# EAGLE design Adafruit 3.5in 480x320 FeatherWing Rev B (EAGLE 9.6.2)
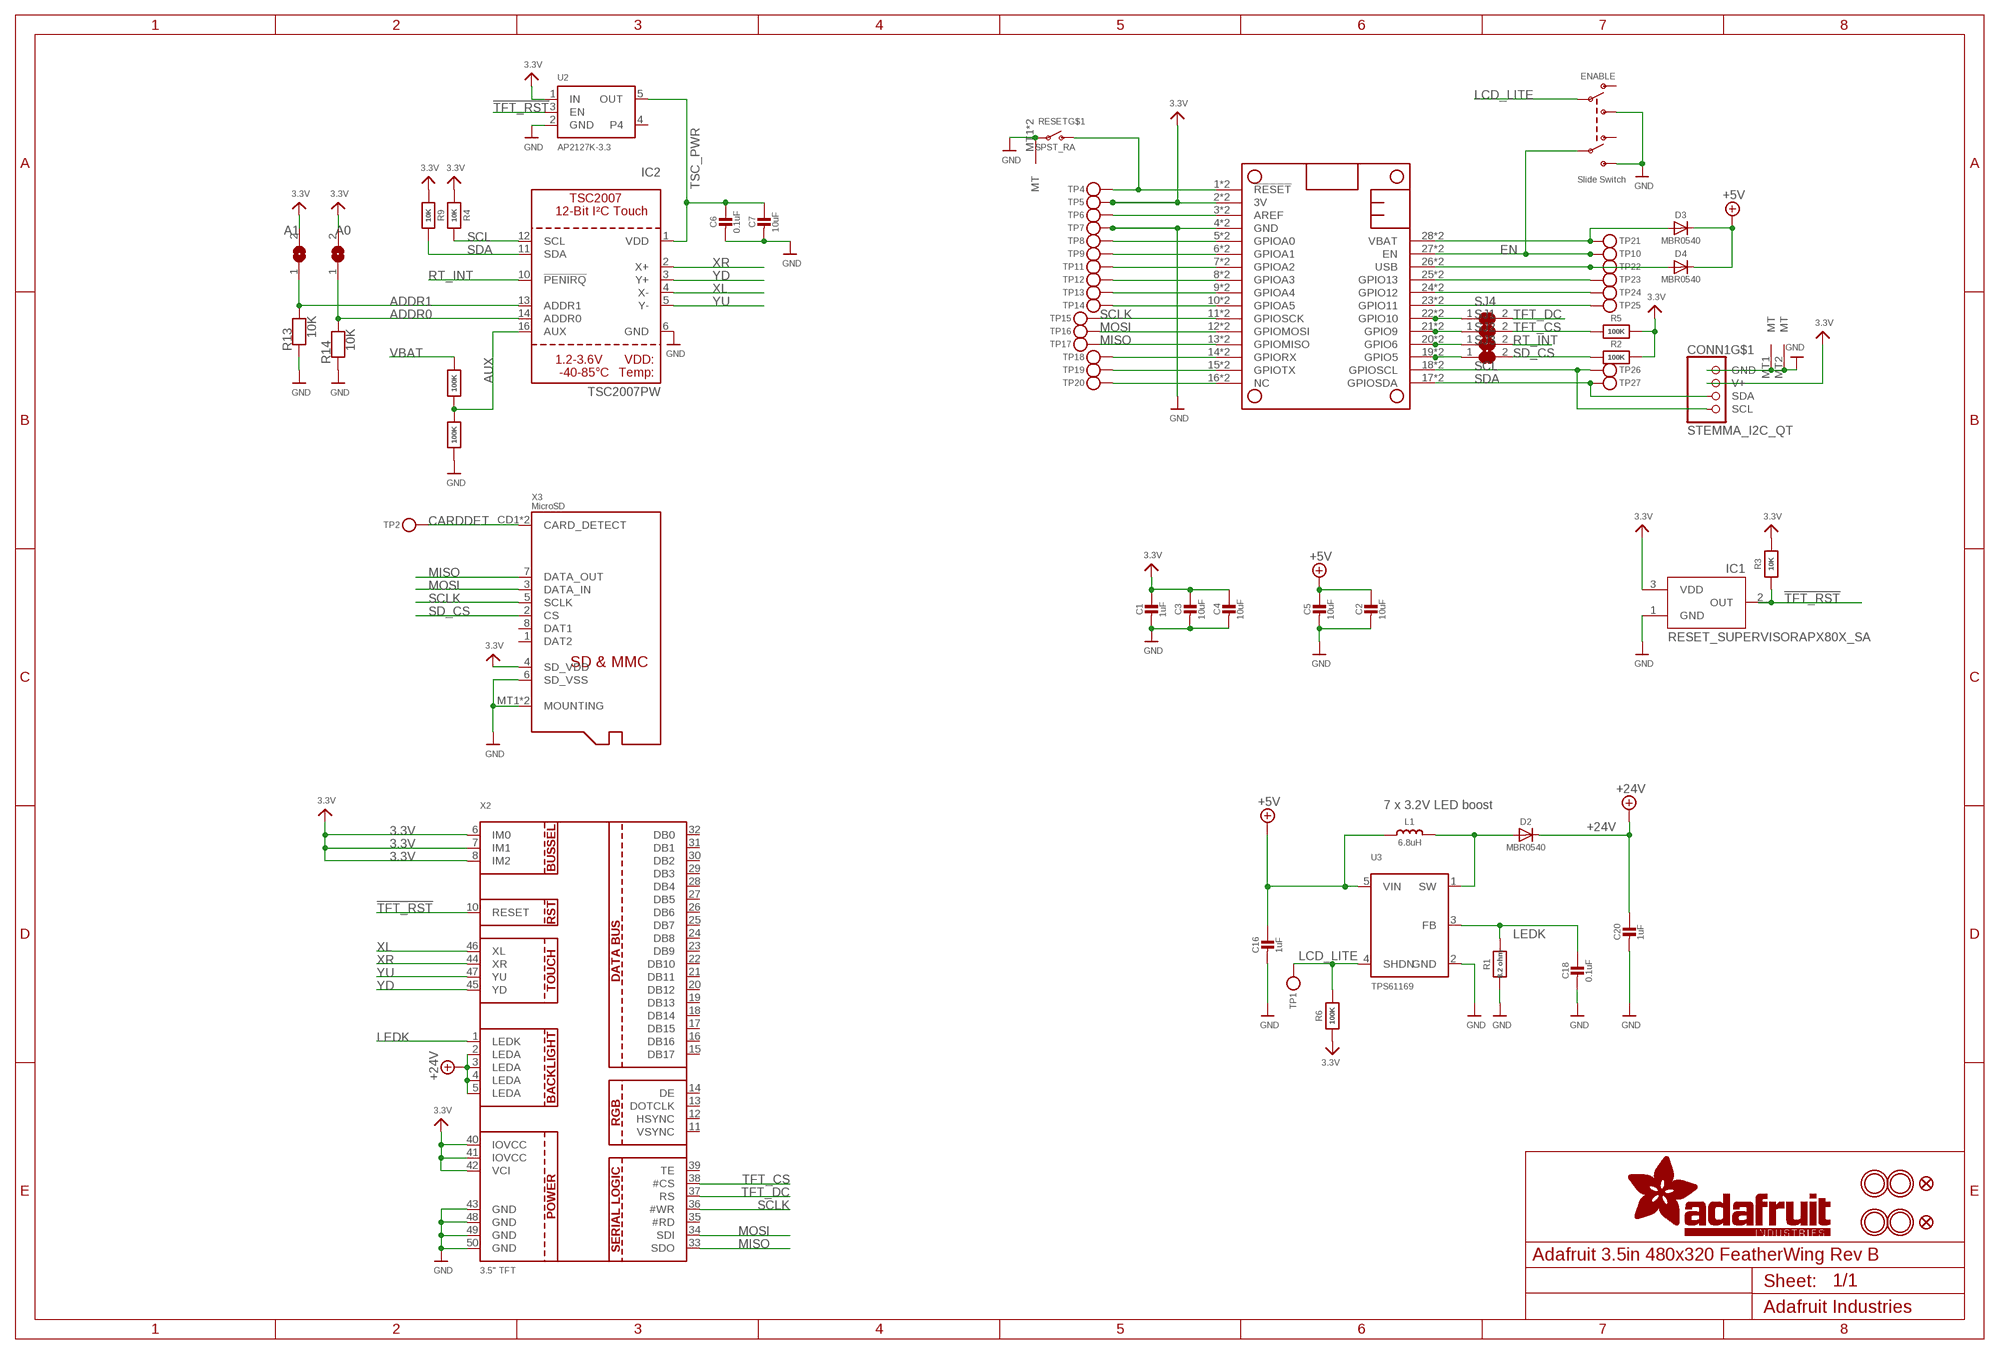
[diagram p0: schematic, sheet 1]

## Parts
C1  1uF  CAP_CERAMIC0805-NOOUTLINE  [0805-NO]
C2  10uF  CAP_CERAMIC0805-NOOUTLINE  [0805-NO]
C3  10uF  CAP_CERAMIC0805-NOOUTLINE  [0805-NO]
C4  10uF  CAP_CERAMIC0805-NOOUTLINE  [0805-NO]
C5  10uF  CAP_CERAMIC0805-NOOUTLINE  [0805-NO]
C6  0.1uF  CAP_CERAMIC0603_NO  [0603-NO]
C7  10uF  CAP_CERAMIC0805-NOOUTLINE  [0805-NO]
C16  1uF  CAP_CERAMIC0805-NOOUTLINE  [0805-NO]
C18  0.1uF  CAP_CERAMIC0603_NO  [0603-NO]
C20  1uF  CAP_CERAMIC0805-NOOUTLINE  [0805-NO]
CONN1  STEMMA_I2C_QT  [JST_SH4]
D2  MBR0540  DIODESOD-123  [SOD-123]
D3  MBR0540  DIODESOD-123  [SOD-123]
D4  MBR0540  DIODESOD-123  [SOD-123]
ENABLE  Slide Switch  SWITCH_DPDTEG1390  [EG1390]
IC1  RESET_SUPERVISORAPX80X_SA  [SOT23-WIDE]
IC2  TSC2007PW  [TSSOP16]
ICSP_CLK1  A1  SOLDERJUMPER  [SOLDERJUMPER_ARROW_NOPASTE]
ICSP_CLK2  A0  SOLDERJUMPER  [SOLDERJUMPER_ARROW_NOPASTE]
L1  6.8uH  INDUCTORNR5040  [INDUCTOR_5X5MM_NR5040_NOTHERMALS]
MS2  FEATHERWING_SMTDUAL  [FEATHERWING_SMT2]
R1  8.2 ohm  RESISTOR_0603_NOOUT  [0603-NO]
R2  100K  RESISTOR_0603_NOOUT  [0603-NO]
R3  10K  RESISTOR_0603_NOOUT  [0603-NO]
R4  10K  RESISTOR_0603_NOOUT  [0603-NO]
R5  100K  RESISTOR_0603_NOOUT  [0603-NO]
R6  100K  RESISTOR_0603_NOOUT  [0603-NO]
R9  10K  RESISTOR_0603_NOOUT  [0603-NO]
R10  100K  RESISTOR_0603_NOOUT  [0603-NO]
R11  100K  RESISTOR_0603_NOOUT  [0603-NO]
R13  10K  RESISTOR_0603_NOOUT  [0603-NO]
R14  10K  RESISTOR_0603_NOOUT  [0603-NO]
RESET  SPST_RA  SWITCH_SPST_MNT_TACT_RA  [SPST_TACTILE_RA]
SJ1  SOLDERJUMPER_CLOSED  [SOLDERJUMPER_CLOSEDWIRE]
SJ2  SOLDERJUMPER_CLOSED  [SOLDERJUMPER_CLOSEDWIRE]
SJ3  SOLDERJUMPER_CLOSED  [SOLDERJUMPER_CLOSEDWIRE]
SJ4  SOLDERJUMPER_CLOSED  [SOLDERJUMPER_CLOSEDWIRE]
TP1  TESTPOINTPAD2MM  [TESTPOINT_PAD_2MM]
TP2  TESTPOINTPAD2MM  [TESTPOINT_PAD_2MM]
TP4  TESTPOINTPAD2MM  [TESTPOINT_PAD_2MM]
TP5  TESTPOINTPAD2MM  [TESTPOINT_PAD_2MM]
TP6  TESTPOINTPAD2MM  [TESTPOINT_PAD_2MM]
TP7  TESTPOINTPAD2MM  [TESTPOINT_PAD_2MM]
TP8  TESTPOINTPAD2MM  [TESTPOINT_PAD_2MM]
TP9  TESTPOINTPAD2MM  [TESTPOINT_PAD_2MM]
TP10  TESTPOINTPAD2MM  [TESTPOINT_PAD_2MM]
TP11  TESTPOINTPAD2MM  [TESTPOINT_PAD_2MM]
TP12  TESTPOINTPAD2MM  [TESTPOINT_PAD_2MM]
TP13  TESTPOINTPAD2MM  [TESTPOINT_PAD_2MM]
TP14  TESTPOINTPAD2MM  [TESTPOINT_PAD_2MM]
TP15  TESTPOINTPAD2MM  [TESTPOINT_PAD_2MM]
TP16  TESTPOINTPAD2MM  [TESTPOINT_PAD_2MM]
TP17  TESTPOINTPAD2MM  [TESTPOINT_PAD_2MM]
TP18  TESTPOINTPAD2MM  [TESTPOINT_PAD_2MM]
TP19  TESTPOINTPAD2MM  [TESTPOINT_PAD_2MM]
TP20  TESTPOINTPAD2MM  [TESTPOINT_PAD_2MM]
TP21  TESTPOINTPAD2MM  [TESTPOINT_PAD_2MM]
TP22  TESTPOINTPAD2MM  [TESTPOINT_PAD_2MM]
TP23  TESTPOINTPAD2MM  [TESTPOINT_PAD_2MM]
TP24  TESTPOINTPAD2MM  [TESTPOINT_PAD_2MM]
TP25  TESTPOINTPAD2MM  [TESTPOINT_PAD_2MM]
TP26  TESTPOINTPAD2MM  [TESTPOINT_PAD_2MM]
TP27  TESTPOINTPAD2MM  [TESTPOINT_PAD_2MM]
U2  AP2127K-3.3  VREG_SOT23-5  [SOT23-5]
U3  TPS61169  VREG_BOOST_5PIN_SC70  [SC70-5]
U$7  MOUNTINGHOLE3.0THIN  [MOUNTINGHOLE_3.0_PLATEDTHIN]
U$9  FIDUCIAL_1MM  [FIDUCIAL_1MM]
U$15  MOUNTINGHOLE3.0THIN  [MOUNTINGHOLE_3.0_PLATEDTHIN]
U$16  MOUNTINGHOLE3.0THIN  [MOUNTINGHOLE_3.0_PLATEDTHIN]
U$17  MOUNTINGHOLE3.0THIN  [MOUNTINGHOLE_3.0_PLATEDTHIN]
U$23  FIDUCIAL_1MM  [FIDUCIAL_1MM]
X2  3.5" TFT  DISP_LCD_3.5IN_320X480_50PIN  [TFT_3.5IN_320X480_50PIN]
X3  MicroSD  MICROSD  [MICROSD]

## Nets
3.3V: C1.1 C3.1 C4.1 CONN1.2(V+) IC1.3(VDD) ICSP_CLK1.2 ICSP_CLK2.2 MS2.2'(3V) MS2.2(3V) R2.2 R3.2 R4.1 R5.2 R6.1 R9.1 TP5.P$1 U2.1(IN) X2.6(IM0) X2.7(IM1) X2.8(IM2) X2.40(IOVCC) X2.41(IOVCC) X2.42(VCI) X3.4(SD_VDD)
!RESET: MS2.1'(!RESET) MS2.1(!RESET) RESET.2(S) TP4.P$1
!TFT_RST: IC1.2(OUT) R3.1 U2.3(EN) X2.10(RESET)
+5V: C2.1 C5.1 C16.1 D3.C D4.C L1.P$1 U3.5(VIN)
+24V: C20.1 D2.C X2.2(LEDA) X2.3(LEDA) X2.4(LEDA) X2.5(LEDA)
A: MS2.5'(GPIOA0) MS2.5(GPIOA0) TP8.P$1
ADDR0: IC2.14(ADDR0) ICSP_CLK2.1 R14.2
ADDR1: IC2.13(ADDR1) ICSP_CLK1.1 R13.2
AREF: MS2.3'(AREF) MS2.3(AREF) TP6.P$1
AUX: IC2.16(AUX) R10.1 R11.2
B: MS2.6'(GPIOA1) MS2.6(GPIOA1) TP9.P$1
C: MS2.7'(GPIOA2) MS2.7(GPIOA2) TP11.P$1
CARDDET: TP2.P$1 X3.CD1(CARD_DETECT) X3.CD2(CARD_DETECT)
D: MS2.8'(GPIOA3) MS2.8(GPIOA3) TP12.P$1
E: MS2.9'(GPIOA4) MS2.9(GPIOA4) TP13.P$1
EN: ENABLE.P2 MS2.27'(EN) MS2.27(EN) TP10.P$1
F: MS2.10'(GPIOA5) MS2.10(GPIOA5) TP14.P$1
G: MS2.16'(NC) MS2.16(NC) TP20.P$1
GND: C1.2 C2.2 C3.2 C4.2 C5.2 C6.2 C7.2 C16.2 C18.2 C20.2 CONN1.1(GND) CONN1.MT1(MT) CONN1.MT2(MT) ENABLE.S1 ENABLE.S2 IC1.1(GND) IC2.6(GND) MS2.4'(GND) MS2.4(GND) R1.1 R11.1 R13.1 R14.1 RESET.1(P) RESET.MT1(MT) RESET.MT2(MT) TP7.P$1 U2.2(GND) U3.2(GND) X2.43(GND) X2.48(GND) X2.49(GND) X2.50(GND) X3.6(SD_VSS) X3.MT1(MOUNTING) X3.MT2(MOUNTING)
H: MS2.19'(GPIO5) MS2.19(GPIO5) SJ3.1
I: MS2.20'(GPIO6) MS2.20(GPIO6) SJ2.1
J: MS2.21'(GPIO9) MS2.21(GPIO9) SJ1.1
K: MS2.22'(GPIO10) MS2.22(GPIO10) SJ4.1
L: MS2.23'(GPIO11) MS2.23(GPIO11) TP25.P$1
LCD_LITE: ENABLE.P1 R6.2 TP1.P$1 U3.4(SHDN)
LEDK: C18.1 R1.2 U3.3(FB) X2.1(LEDK)
M: MS2.24'(GPIO12) MS2.24(GPIO12) TP24.P$1
MISO: MS2.13'(GPIOMISO) MS2.13(GPIOMISO) TP17.P$1 X2.33(SDO) X3.7(DATA_OUT)
MOSI: MS2.12'(GPIOMOSI) MS2.12(GPIOMOSI) TP16.P$1 X2.34(SDI) X3.3(DATA_IN)
N: MS2.25'(GPIO13) MS2.25(GPIO13) TP23.P$1
N$3: D2.A L1.P$2 U3.1(SW)
RT_INT: IC2.10(!PENIRQ) SJ2.2
RX: MS2.14'(GPIORX) MS2.14(GPIORX) TP18.P$1
SCL: CONN1.4(SCL) IC2.12(SCL) MS2.18'(GPIOSCL) MS2.18(GPIOSCL) R4.2 TP26.P$1
SCLK: MS2.11'(GPIOSCK) MS2.11(GPIOSCK) TP15.P$1 X2.36(#WR) X3.5(SCLK)
SD_CS: R2.1 SJ3.2 X3.2(CS)
SDA: CONN1.3(SDA) IC2.11(SDA) MS2.17'(GPIOSDA) MS2.17(GPIOSDA) R9.2 TP27.P$1
TFT_CS: R5.1 SJ1.2 X2.38(#CS)
TFT_DC: SJ4.2 X2.37(RS)
TSC_PWR: C6.1 C7.1 IC2.1(VDD) U2.5(OUT)
TX: MS2.15'(GPIOTX) MS2.15(GPIOTX) TP19.P$1
USB: D4.A MS2.26'(USB) MS2.26(USB) TP22.P$1
VBAT: D3.A MS2.28'(VBAT) MS2.28(VBAT) R10.2 TP21.P$1
XL: IC2.4(X-) X2.46(XL)
XR: IC2.2(X+) X2.44(XR)
YD: IC2.3(Y+) X2.45(YD)
YU: IC2.5(Y-) X2.47(YU)
Unconnected: ENABLE.O1 ENABLE.O2 U2.4 X2.11(VSYNC) X2.12(HSYNC) X2.13(DOTCLK) X2.14(DE) X2.15(DB17) X2.16(DB16) X2.17(DB15) X2.18(DB14) X2.19(DB13) X2.20(DB12) X2.21(DB11) X2.22(DB10) X2.23(DB9) X2.24(DB8) X2.25(DB7) X2.26(DB6) X2.27(DB5) X2.28(DB4) X2.29(DB3) X2.30(DB2) X2.31(DB1) X2.32(DB0) X2.35(#RD) X2.39(TE) X3.1(DAT2) X3.8(DAT1)

## Notes on the sheet
- 7 x 3.2V LED boost

## Library data of the parts
C1-C7 C16 C18 C20 = microbuilder:CAP_CERAMIC: Ceramic Capacitors For new designs, use the packages preceded by an '_' character since they are more reliable: The following footprints should be used on most boards: _0402 - Standard footprint for regular board layouts _0603 - Standard footprint for regular board layouts _0805 - Standard footprint for regular board layouts _1206 - Standard footprint for regular board layouts For extremely tight-pitch boards where space is at a premium, the following 'micro-pitch' footprints can be used (smaller pads, no silkscreen outline, etc.): _0402MP - Micro-pitch footprint for very dense/compact boards _0603MP - Micro-pitch footprint for very dense/compact boards _0805MP - Micro-pitch footprint for very dense/compact boards _1206MP - Micro-pitch footprint for very dense/compact boards
CONN1 = adafruit_electromech:STEMMA_I2C; LCSC: C2845363
D2-D4 = microbuilder:DIODE: Diode SMA Model Volts Amps Type Vf Ir Digikey # Notes SSA34-E3 40V 3A Schottky 480mV @ 3A 200uA @ 40V SSA34-E3/61TGITR-ND CDBA120-G 20V 1A Schottky 500mV @ 1A 500uA @ 20V 641-1014-6-ND REEL MBRA210 10V 2A Schottky 350mV @ 2A 700uA @ 10V MBRA210LT3 SOD-123 Model Volts Amps Type Vf Ir Order # Notes BAT54T1G 30V 200mA Schottky 800mV @ 200mA 2uA @ 25V BAT54T1GOSTR-ND B0530W 30V 500mA Schottky 430mV @ 500mA 130uA @ 30V B0530W-FDICT-ND REEL MBR120 20V 1A Schottky 340mV @ 1A MBR120VLSFT1GOSCT-ND SOD-323 Model Volts Amps Type Vf Ir Order # Notes PMEG2005EJ 20V 500mA Schottky 355mV @ 500mA 568-4110-1-ND ZLLS410 10V 570mA Schottky 380mV @ 570mA ZLLS410CT-ND 1N4148WS 75V 150mA Silicon/Simple 1V 1N4148WSFSCT-ND REEL SOD-523 Model Volts Amps Type Vf Ir Order # Notes BAT54XV2 30V 200mA Schottky 0.8V @ 100mA BAT54XV2CT-ND TB751S 30V 30mA Schottky RB751S-40TE61CT-ND SOT23-R/W (R = Solder Paste/Reflow Ovens, W = Hand-Soldering) Model Volts Amps Type Vf Ir Order # Notes BAT54FILM 40V 300mA Schottky 497-7162-1-ND POWERDI-5 Model Volts Amps Type Vf Ir Order # Notes PDS560 60V 5A Schottky 670mV @ 5A 150uA @ 60V PDS560DICT-ND
ENABLE = adafruit_electromech:SWITCH_DPDT: Switch - DPDT A DPDT Switch acts like an SPDT switch, but has a pair of switches instead of just one. Vertical - 0.3A @ 6V SMT - Digikey: JS202011SCQN; LCSC: C2837066
IC1 = adafruit_power:RESET_SUPERVISOR; ROT: 270
IC2 = adafruit_sensor:TSC2007
ICSP_CLK1 ICSP_CLK2 = microbuilder:SOLDERJUMPER: SMD Solder JUMPER Solder the two pads together to create a connection, or remove the solder to break it. REFLOW - Use this footprint for solder paste and reflow ovens. WAVE - Use this footprint for hand-soldering (larger pads). CLOSED - Has a trace between the two pads to ensure it is closed by default. The trace needs to be cut to disable the jumper, and can be closed again by creating a solder bridge between the two pads.; BOM: EXCLUDE
L1 = microbuilder:INDUCTOR: Inductors 0603: 10nH Ceramic Inductor - microwire antenna/RF (Digikey: 712-1434-2-ND) 0805: 560nH Ceramic Inductor - RF (Digikey: 553-1047-1-ND) 270nH Ceramic Inductor - Q = 40@250MHz, +-5%, 1 Ohm DC Resistance (Digikey: 535-10506-2-ND) 1007 (2518 Metric) SMT: 10µH 10% 250mOhm 820mA 1007 Inductor (Digikey: 587-2189-1-ND) 22µH 10% 500mOhm 580mA 1007 Inductor (Digikey: 587-2190-1-ND) 47µH 10% 950mOhm 420mA 1007 Inductor (Digikey: 587-2191-1-ND) 47µH 5% 100mOhm 1A 1008 Inductor (Digikey: 732-1816-1-ND) 5.0x5.0mm (Taiyo Yuden NR5040 Series) 6.8µH 20% 2.3A 64mOhm Inductor (Digikey: 587-2374-2-ND) 5.0x5.0mm (TDK VLC5045 Series) 4.7µH 20% 3.3A 34mOhm Inductor (Digikey: 445-6526-1-ND) 6.8µH 20% 2.7A 46mOhm Inductor (Digikey: 445-6527-1-ND) 6.0x6.0mm (TDK VLC6045 Series) 4.7µH 20% 3.8A 27mOhm Inductor (Digikey: 445-6538-2-ND) 6.8µH 20% 3A 41mOhm Inductor (Digikey: 445-6540-1-ND) 6.2µH 30% 2.2A 45mOhm Inductor (Digikey: SRR5028-6R2YCT-ND) - Not TDK VLC6045 but footprint should match 6.0x6.0mm (TDK SLF6045 Series) 6.8uH 30% 2A 33mOhm Inductor (Digikey: 445-4572-1-ND, Mouser: 810-SLF645T6R8N2R0PF) 6.0x6.0mm (Sumida CDRH5D28 Series) 6.2uH 30% 1.8A 45mOhm Inductor (Digikey: 308-1542-1-ND) Taiyo Yuden NR3015T2R2M - 2.2uH 20% 1.5A (Digikey: 587-1648-2-ND, Mouser: 963-NR3015T2R2M) - Used with TI TPS62172 CoilCraft RFID Transponder Coil - MA5532-AE (For use with AS3935 Lightning Sensor) Taiyo Yuden NRH2412T2R2MNGH - 2.2uH 20% 1AA (Digikey: 587-3443-1-ND) - Used with TI LM3671 Vishay IHLP 1.0uH Molded Inductor - 24mOhm DCR, 5A, +/-20%, -55°C-125°C (Digikey: 541-1319-1-ND)
MS2 = microbuilder:FEATHERWING
R1-R6 R9-R11 R13 R14 = microbuilder:RESISTOR: Resistors For new designs, use the packages preceded by an '_' character since they are more reliable: The following footprints should be used on most boards: _0402 - Standard footprint for regular board layouts _0603 - Standard footprint for regular board layouts _0805 - Standard footprint for regular board layouts _1206 - Standard footprint for regular board layouts For extremely tight-pitch boards where space is at a premium, the following 'micro-pitch' footprints can be used (smaller pads, no silkscreen outline, etc.): _0402MP - Micro-pitch footprint for very dense/compact boards _0603MP - Micro-pitch footprint for very dense/compact boards _0805MP - Micro-pitch footprint for very dense/compact boards _1206MP - Micro-pitch footprint for very dense/compact boards
RESET = adafruit_electromech:SWITCH_SPST_MNT: Switch - SPST 4UCon 19192 (6.7x2.6mm SMT); LCSC: C778159
SJ1-SJ4 = microbuilder:SOLDERJUMPER_CLOSED: Solder Jumper - Closed These solder jumpers are closed by default CLOSEDWIRE - 10 mil trace between pads that can be cut and resoldered later CLOSEDPERM - 63 mil trace between pads for a permanent connection (used to 'bridge' two signals, a shameless hack for Eagle). Can double as a test point as well (no cream layer)
TP1 TP2 TP4-TP27 = microbuilder:TESTPOINT: Test Point Various test points for characterisation and PCB testing TESTPOINT_SMT - Compact Surface Mount Test Point [Digikey: 5016KTR-ND]
U2 = adafruit_power:VREG_SOT23-5: SOT23-5 Fixed Voltage Regulators Part Current Out V Out V In V Dropout θJA (°C/W) TJ (°C) Digikey Part No. ADP121 150mA 3.3V 3.4-5.5V 0.09V @ 150mA -- -- ADP121-AUJZ33R7CT-ND ADP121 150mA 3.0V 3.1-5.5V 0.09V @ 150mA -- -- ADP121-AUJZ30R7CT-ND ADP122 300mA 3.3V 3.4-5.5V 0.085V @ 300mA -- -- ADP122AUJZ-3.3-R7CT-ND ADP1712 300mA 3.3V 3.5-5.5V 0.17V @ 300mA -- -- ADP1712AUJZ-3.3-R7TR-ND AP7311 (Low Cost) 150mA 3.3V 3.5-6V 0.15V @ 150mA -- -- AP7311-33WG-7DICT-ND LD39015M18R 150mA 1.8V 1.9V-5.5V 0.08V @ 100mA -- -- 497-6977-1-ND LP2985A-33DBVR 150mA 3.3V 3.3-16V 0.28V @ 150mA 206 150 296-18479-1-ND MCP1824T-3302E/OT 300mA 3.3V 3.5V-6V 0.2V @ 300mA -- -- MCP1824T-3302E/OTCT-ND MIC5205-2.5YM5 TR 150mA 2.5V 2.7-16V 0.165V @ 150mA -- -- 576-1257-2-ND MIC5205-3.0YM5 TR 150mA 3.0V 3.2V-16V 0.165V @ 150mA -- -- 576-1258-2-ND MIC5205-3.3YM5 TR 150mA 3.3V 3.5V-16V 0.165V @ 150mA -- -- 576-1259-2-ND TPS780330220 150mA 3.3V+2.2V 3.6-5.5V 250mV Max -- -- 296-23332-1-ND TDA3663/N1,135 100mA 3.3V 3.5-45V 0.18V @ 50mA -- -- 568-5343-1-ND Max operating temp can be calculated using θJA, TJ (max junction temperature), and power in watts. Set the "Maximum Ambient Temperature" until it reaches TJ ("Max Junction Temperature"), which is the absolute limit for safe use of the regulator: Heat Sink Temperature Calculator <http://www.daycounter.com/Calculators/Heat-Sink-Temperature-Calculator.phtml> For example, With 12V source into a 3.3V LP2985 and a 30mA load, we are dissipating (12V-3.3V) * 0.03A = 0.261W. With a θJA of 206 °C/W, a TJ of 150°C, and 261mW we can safely use the chip without a heat sink up to 75°C (=147.1°C Junction Temperature).; JLC_ROTATION: 270
U3 = adafruit_power:VREG_BOOST_5PIN: FAN5331 - LED/OLED 20V Boost Converter Digikey: FAN5331SXCT-ND
U$7 U$15-U$17 = adafruit_electromech:MOUNTINGHOLE: Mounting Hole For #2 screws (0.086"/2.18mm width, 0.094"/2.4mm hole) use 2.5mm; BOM: EXCLUDE
U$9 U$23 = microbuilder:FIDUCIAL: Fiducial Alignment Points Various fiducial points for machine vision alignment.; BOM: EXCLUDE
X2 = adafruit_display:DISP_LCD_3.5IN_320X480_50PIN: DT350HV15-T - 3.5" 320x480 TFT Display, 50 Pin Connector
X3 = adafruit_electromech:MICROSD: MicroSD/Transflash Card Holder with SPI pinout 3M: 2908-05WB-MG 4UConnector: 19656 Footprint courtesy: Adafruit Industries; JLC_ROTATION: 90; LCSC: C125617

## Board
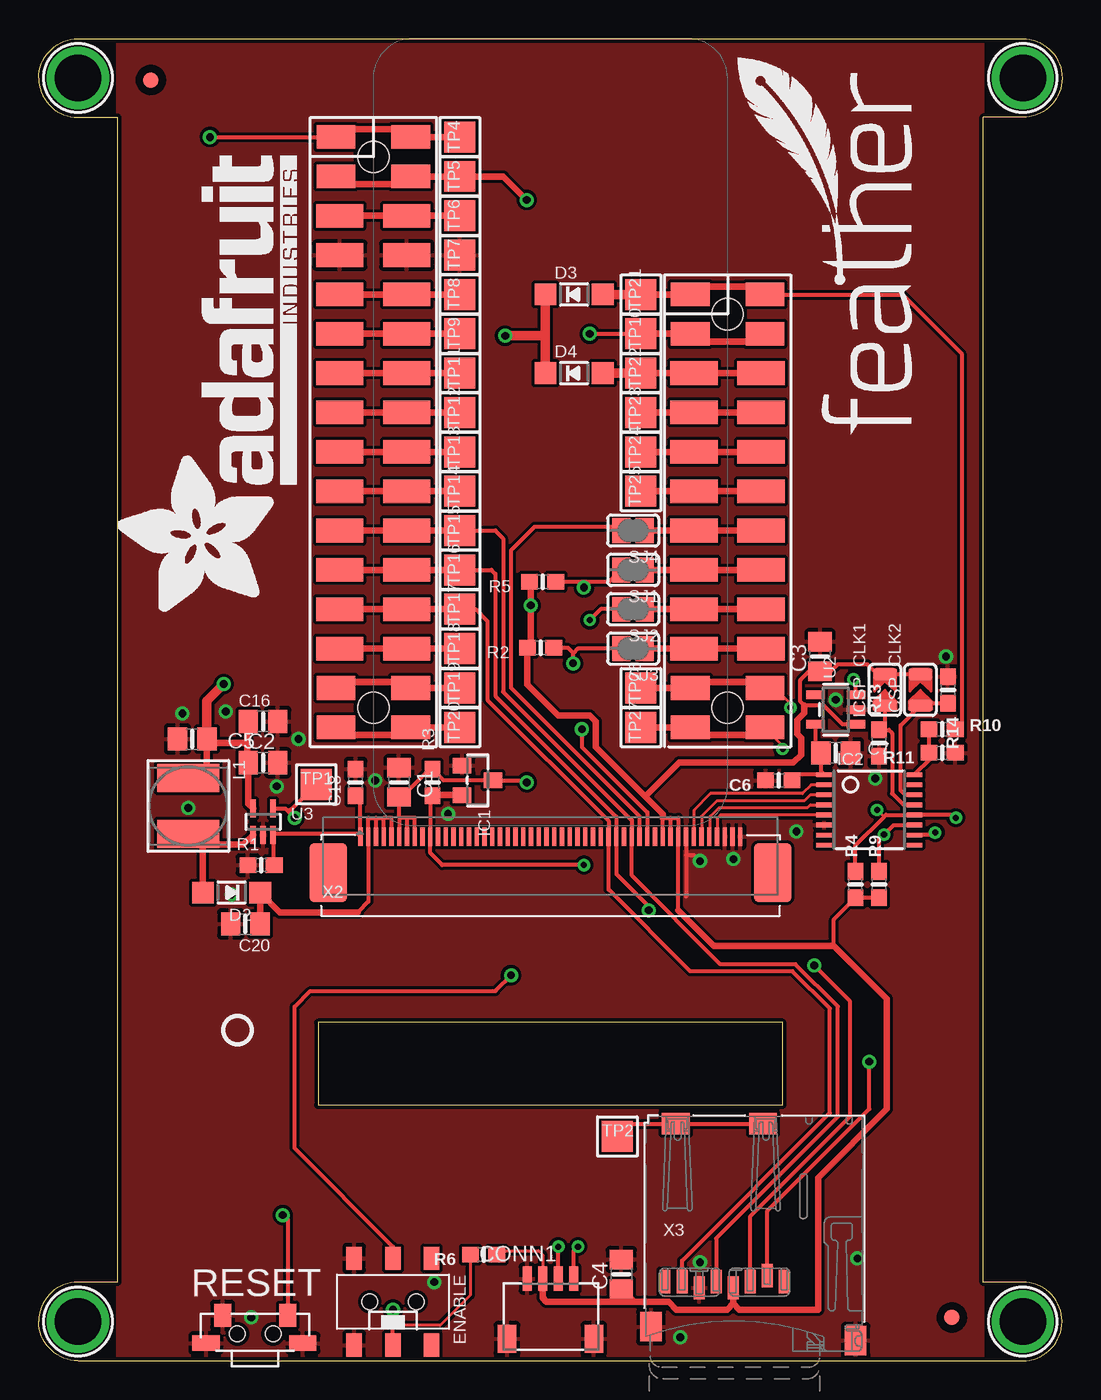
[diagram p1: board, top side]
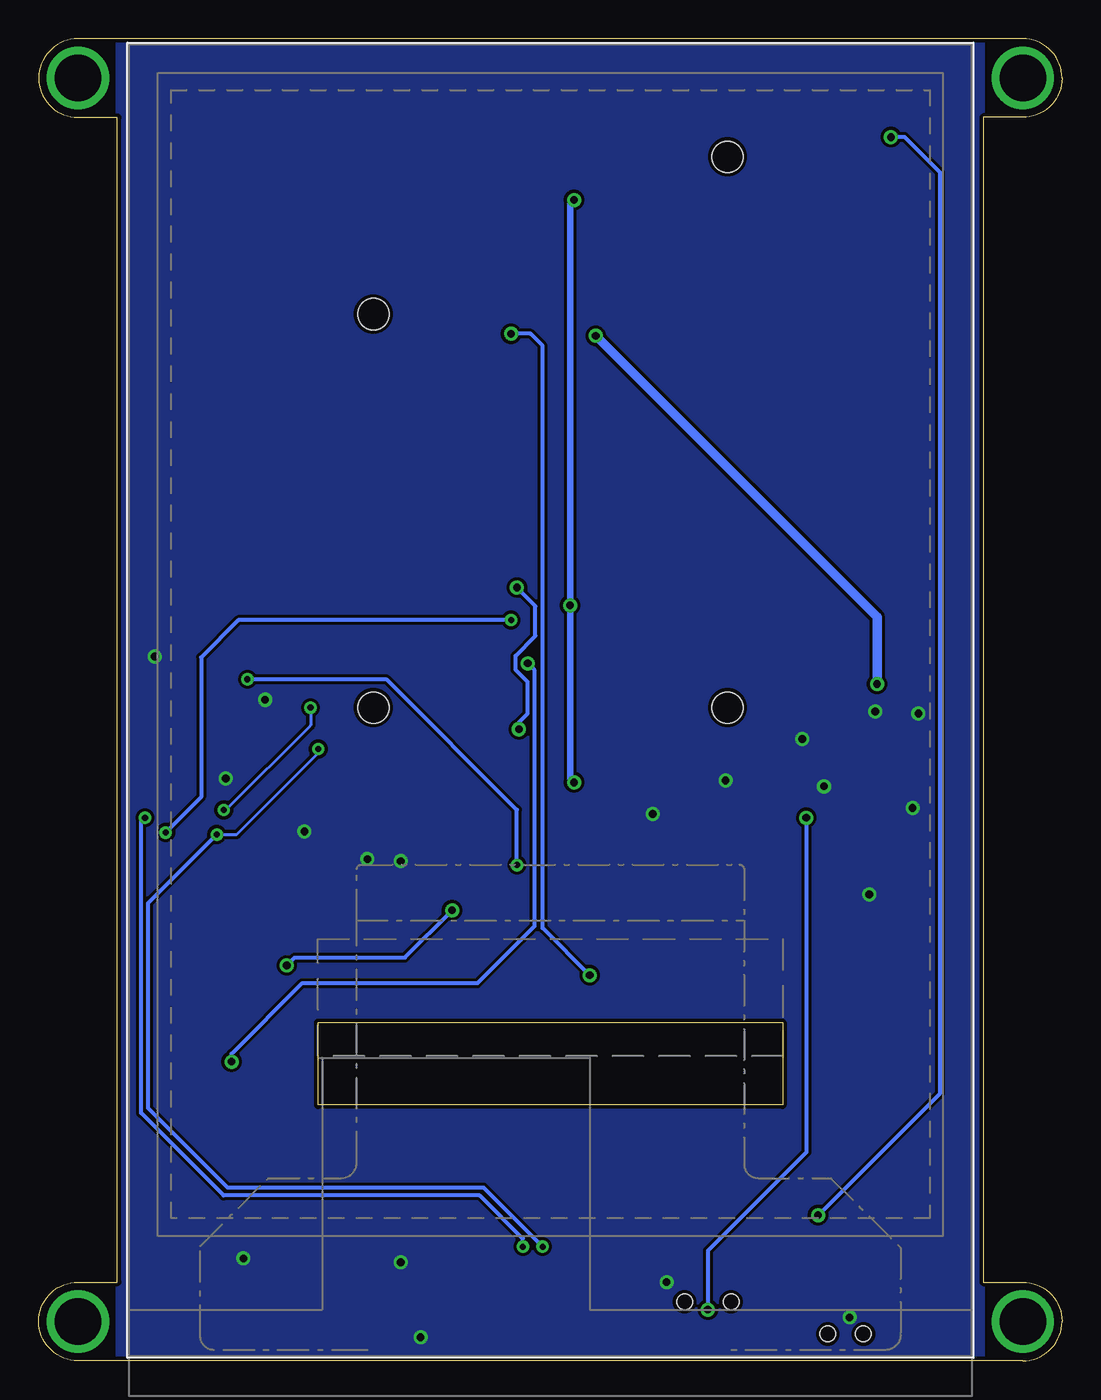
[diagram p2: board, bottom side, seen from below]

Size 66.04 x 85.34 mm. Coordinates in mm from the lower left corner, seen from the top.
Outline: 2.54,0 63.5,0 arc90 66.04,2.54 arc90 63.5,5.08 60.96,5.08 60.96,80.26 63.5,80.26 arc90 66.04,82.8 arc90 63.5,85.34 2.54,85.34 arc90 0,82.8 arc90 2.54,80.26 5.08,80.26 5.08,5.08 2.54,5.08 arc90 0,2.54 arc90 2.54,0
Outline: 18.03,21.84 18.03,16.51 48.01,16.51 48.01,21.84 18.03,21.84
Copper layers (1*16): Top 0.035mm / dielectric 1.5mm / Bottom 0.035mm
Design rules "adafruit *": minimum track width 8mil, minimum drill 15.5mil, track to track 8mil, track to pad 8mil, pad to pad 8mil, via to via 8mil, smd to smd 8mil, copper to edge 10mil, drill to drill 8mil, minimum pad ring 10mil, minimum via ring 8mil, stop-mask expansion 2mil, vias tented up to drill 20mil, thermal gap 10mil
tRestrict: area 44.5,33.7 to 44.6,34; area 45,33.7 to 45.1,34

### Footprints (pad centres in the part's own frame; a part is rotated, then mirrored left to right if it is on the bottom)
0805-NO = smd 1.24 x 1.5: 1 -0.95,0; 2 0.95,0
0603-NO = smd 1.075 x 1: 1 -0.85,0; 2 0.85,0
JST_SH4 = smd 0.6 x 1.55: 1 -1.5,2.006; 2 -0.5,2.006; 3 0.5,2.006; 4 1.5,2.006 | smd 1.2 x 1.8: MT1 -2.8,-1.894; MT2 2.8,-1.894
SOD-123 = smd 1.4 x 1.4: A 1.85,0; C -1.85,0
EG1390 = smd 1 x 1.5: O1 -2.5,2.8; O2 -2.5,-2.8; P1 0,2.8; P2 0,-2.8; S1 2.5,2.8; S2 2.5,-2.8 | hole 1: 1.5,0; -1.5,0
SOT23-WIDE = smd 1 x 1.2: 1 -0.95,-1; 2 0.95,-1; 3 0,1
TSSOP16 = smd 0.305 x 0.991: 1 -2.275,-2.918; 2 -1.625,-2.918; 3 -0.975,-2.918; 4 -0.325,-2.918; 5 0.325,-2.918; 6 0.975,-2.918; 7 1.625,-2.918; 8 2.275,-2.918; 9 2.275,2.918; 10 1.625,2.918; 11 0.975,2.918; 12 0.325,2.918; 13 -0.325,2.918; 14 -0.975,2.918; 15 -1.625,2.918; 16 -2.275,2.918
SOLDERJUMPER_ARROW_NOPASTE = smd 0.762 x 1.524: 1 -1.016,0; 2 1.016,0
INDUCTOR_5X5MM_NR5040_NOTHERMALS = smd 1.8 x 4: P$1 -1.8,0; P$2 1.8,0
FEATHERWING_SMT2 = smd 1.524 x 2.5: 1 6.35,2.413; 1' 6.35,-2.413; 2 8.89,2.413; 2' 8.89,-2.413; 15 41.91,2.413; 15' 41.91,-2.413; 16 44.45,2.413; 16' 44.45,-2.413; 17 44.45,20.447; 17' 44.45,25.273; 18 41.91,20.447; 18' 41.91,25.273; 27 19.05,20.447; 27' 19.05,25.273; 28 16.51,20.447; 28' 16.51,25.273 | smd 1.524 x 3.048: 3 11.43,2.159; 3' 11.43,-2.159; 4 13.97,2.159; 4' 13.97,-2.159; 5 16.51,2.159; 5' 16.51,-2.159; 6 19.05,2.159; 6' 19.05,-2.159; 7 21.59,2.159; 7' 21.59,-2.159; 8 24.13,2.159; 8' 24.13,-2.159; 9 26.67,2.159; 9' 26.67,-2.159; 10 29.21,2.159; 10' 29.21,-2.159; 11 31.75,2.159; 11' 31.75,-2.159; 12 34.29,2.159; 12' 34.29,-2.159; 13 36.83,2.159; 13' 36.83,-2.159; 14 39.37,2.159; 14' 39.37,-2.159; 19 39.37,20.701; 19' 39.37,25.019; 20 36.83,20.701; 20' 36.83,25.019; 21 34.29,20.701; 21' 34.29,25.019; 22 31.75,20.701; 22' 31.75,25.019; 23 29.21,20.701; 23' 29.21,25.019; 24 26.67,20.701; 24' 26.67,25.019; 25 24.13,20.701; 25' 24.13,25.019; 26 21.59,20.701; 26' 21.59,25.019 | hole 2: 17.78,22.86; 43.18,22.86; 7.62,0; 43.18,0
SPST_TACTILE_RA = smd 1.1 x 1.5: 1 2.1,-0.9; 2 -2.1,-0.9 | smd 1.75 x 1: MT1 3.175,0.9; MT2 -3.075,0.9 | hole 1: 1.15,0.3; -1.15,0.3
SOLDERJUMPER_CLOSEDWIRE = smd 1.168 x 1.6: 1 -0.762,0; 2 0.762,0 | smd 0.635 x 0.203: WIRE 0,0
TESTPOINT_PAD_2MM = smd 2 x 2: P$1 0,0
SOT23-5 = smd 0.55 x 1.2: 1 -0.95,-1.3; 2 0,-1.3; 3 0.95,-1.3; 4 0.95,1.3; 5 -0.95,1.3
SC70-5 = smd 0.35 x 1.15: 1 -0.65,-0.85; 2 0,-0.85; 3 0.65,-0.85; 4 0.65,0.85; 5 -0.65,0.85
MOUNTINGHOLE_3.0_PLATEDTHIN = drill 3 pad 3.6: P$1 0,0
FIDUCIAL_1MM = smd 1 x 1: 1 0,0
TFT_3.5IN_320X480_50PIN = smd 0.275 x 1.2 bottom: 1 12.25,1.066; 2 11.75,1.066; 3 11.25,1.066; 4 10.75,1.066; 5 10.25,1.066; 6 9.75,1.066; 7 9.25,1.066; 8 8.75,1.066; 9 8.25,1.066; 10 7.75,1.066; 11 7.25,1.066; 12 6.75,1.066; 13 6.25,1.066; 14 5.75,1.066; 15 5.25,1.066; 16 4.75,1.066; 17 4.25,1.066; 18 3.75,1.066; 19 3.25,1.066; 20 2.75,1.066; 21 2.25,1.066; 22 1.75,1.066; 23 1.25,1.066; 24 0.75,1.066; 25 0.25,1.066; 26 -0.25,1.066; 27 -0.75,1.066; 28 -1.25,1.066; 29 -1.75,1.066; 30 -2.25,1.066; 31 -2.75,1.066; 32 -3.25,1.066; 33 -3.75,1.066; 34 -4.25,1.066; 35 -4.75,1.066; 36 -5.25,1.066; 37 -5.75,1.066; 38 -6.25,1.066; 39 -6.75,1.066; 40 -7.25,1.066; 41 -7.75,1.066; 42 -8.25,1.066; 43 -8.75,1.066; 44 -9.25,1.066; 45 -9.75,1.066; 46 -10.25,1.066; 47 -10.75,1.066; 48 -11.25,1.066; 49 -11.75,1.066; 50 -12.25,1.066 | smd 2.4 x 3.81 bottom: PAD1 14.35,-1.253; PAD2 -14.35,-1.253
MICROSD = smd 0.7 x 1.5: 1 1.761,-3.147; 2 0.661,-2.747; 3 -0.439,-3.147; 4 -1.539,-3.547; 5 -2.639,-3.147; 6 -3.739,-3.547; 7 -4.839,-3.147; 8 -5.939,-3.147 | smd 1.8 x 1.4: CD1 -5.239,7.053; CD2 0.38,7.053 | smd 1.4 x 1.9: MT1 -6.839,-6.047; MT2 6.361,-6.947

### Placement (x,y rotation side)
C1  23.24,37.34 90 top
C2  14.48,38.61 0 top
C3  50.42,45.47 90 top
C4  37.59,5.59 90 top
C5  9.91,40.13 180 top
C6  47.75,37.46 180 top
C7  51.44,39.24 0 top
C16  14.48,41.27 0 top
C18  20.45,37.34 90 top
C20  13.34,28.19 180 top
CONN1  33.02,3.3 0 top
D2  12.45,30.23 180 top
D3  34.54,68.83 0 top
D4  34.54,63.75 0 top
ENABLE  22.86,3.81 180 top
IC1  28.32,37.46 270 top
IC2  53.59,35.56 270 top
ICSP_CLK1  54.61,43.31 90 top
ICSP_CLK2  56.9,43.31 90 top
L1  9.65,35.81 270 top
MS2  21.59,85.34 270 top
PLABEL0  [PLABEL0]  28.19,2.92 90 top
PLABEL1  [PLABEL1]  18.92,2.67 90 top
PLABEL2  [PLABEL2]  11.3,3.94 0 top
PLABEL3  [PLABEL3]  19.81,7.87 0 top
PLABEL4  [PLABEL4]  17.27,34.54 0 top
PLABEL5  [PLABEL5]  36.45,53.59 0 top
PLABEL6  [PLABEL6]  36.45,51.05 0 top
PLABEL7  [PLABEL7]  36.45,48.64 0 top
PLABEL8  [PLABEL8]  36.45,45.97 0 top
PLABEL9  [PLABEL9]  8.64,17.78 90 top
PLABEL10  [PLABEL10]  57.4,45.47 90 top
PLABEL11  [PLABEL11]  55.12,45.47 90 top
PLABEL12  [PLABEL12]  38.73,12.19 0 top
PLABEL13  [PLABEL13]  59.69,14.48 90 top
PLABEL14  [PLABEL14]  55.63,0.76 90 top
PLABEL15  [PLABEL15]  30.23,6.6 0 top
R1  14.35,32 0 top
R2  32.39,46.04 180 top
R3  25.4,37.34 90 top
R4  52.7,30.73 90 top
R5  32.51,50.29 180 top
R6  28.7,6.86 180 top
R9  54.23,30.73 90 top
R10  58.29,40.77 0 top
R11  58.29,39.24 180 top
R13  54.23,39.88 90 top
R14  58.67,43.31 270 top
RESET  13.97,2.03 180 top
SJ1  38.35,51.05 180 top
SJ2  38.35,48.51 180 top
SJ3  38.35,45.97 180 top
SJ4  38.35,53.59 180 top
TP1  17.91,37.21 0 top
TP2  37.34,14.48 0 top
TP4  27.18,78.99 90 top
TP5  27.18,76.45 90 top
TP6  27.18,73.91 90 top
TP7  27.18,71.37 90 top
TP8  27.18,68.83 90 top
TP9  27.18,66.29 90 top
TP10  38.86,66.29 90 top
TP11  27.18,63.75 90 top
TP12  27.18,61.21 90 top
TP13  27.18,58.67 90 top
TP14  27.18,56.13 90 top
TP15  27.18,53.59 90 top
TP16  27.18,51.05 90 top
TP17  27.18,48.51 90 top
TP18  27.18,45.97 90 top
TP19  27.18,43.43 90 top
TP20  27.18,40.89 90 top
TP21  38.86,68.83 90 top
TP22  38.86,63.75 90 top
TP23  38.86,61.21 90 top
TP24  38.86,58.67 90 top
TP25  38.86,56.13 90 top
TP26  38.86,43.43 90 top
TP27  38.86,40.89 90 top
U2  51.44,42.04 90 top
U3  14.48,34.8 0 top
U$7  2.54,2.54 0 top
U$9  58.93,2.79 0 top
U$11  [FEATHERLOGO]  56.39,59.82 90 top
U$15  63.5,2.54 0 top
U$16  2.54,82.8 0 top
U$17  63.5,82.8 0 top
U$19  [ADAFRUIT_TEXT_30MM]  16.64,48.13 90 top
U$23  7.24,82.68 0 top
U$37  [PCBFEAT-REV-040]  12.83,21.34 90 top
X2  33.02,32.77 0 bottom
X3  46.36,8.25 0 top

### Tracks (layer width: path | path; a pad name or v marks a point on that pad's centre or on a via)
3.3V  (via drill 0.5)
  Top 0.203: R6.1 29.81,7.11 32.26,7.11 32.52,6.85 CONN1.2
  Top 0.254: 23.77,35.05 23.27,35.05 | X2.8 24.27,35.05 23.77,35.05 | X2.7 23.77,35.05 | 23.27,35.05 23.27,36.39 C1.1 23.43,36.39 25.23,38.19 R3.2 26.12,37.46 IC1.3 31.37,37.46 v31.5,37.34 | 40.77,35.05 40.27,35.05 X2.40 | X2.41 40.77,35.05 | 41.27,29.09 X2.42 41.27,35.05 40.77,35.05 | 23.27,35.05 X2.6 | ICSP_CLK2.2 ICSP_CLK1.2 54.1,44.32 53.47,44.96 51.56,44.96 51.12,44.52 C3.1 49.72,44.52 49.15,43.94 49.15,42.55 49.4,42.29 50.67,42.29 51.88,41.09 U2.1 | R9.1 R4.1 51.31,28.49 51.31,26.8
  Top 0.406: X3.4 44.82,3.7 | 44.82,3.7 45.21,3.3 50.29,3.3 50.29,11.81 54.74,16.26 54.74,23.37 51.31,26.8 43.56,26.8 41.27,29.09 | 38.42,3.81 40.64,3.81 41.15,3.3 44.42,3.3 44.82,3.7 | C4.1 38.42,3.81 | v31.5,74.93 29.97,76.45 TP5.P$1 MS2.2 23.88,76.45 23.37,75.95 19.69,75.95 MS2.2' | 40.27,35.05 40.27,35.3 39.15,36.42 | 39.15,36.42 35.94,39.62 35.94,41.27 35.56,41.66 33.53,41.66 31.54,43.65 R2.2 31.75,46.25 v31.75,48.77 31.75,50.2 R5.2 | 39.15,36.42 41.34,38.61 48.7,38.61 49.21,39.12 49.21,40.2 48.96,40.45 48.96,41.36 49.4,41.8 49.4,42.29 | CONN1.2 32.52,4.06 32.77,3.81 38.42,3.81
  Bottom 0.254: v31.5,37.34 31.75,37.59 | 31.75,48.01 v31.75,48.77
  Bottom 0.406: 31.75,37.59 31.75,48.01 31.75,74.68 v31.5,74.93
!RESET  (via drill 0.5)
  Top 0.254: v11.05,78.99 MS2.1' | v15.75,9.4 16.07,9.08 RESET.2
  Top 0.406: TP4.P$1 MS2.1 23.75,78.99 23.24,79.5 19.69,79.5 MS2.1'
  Bottom 0.254: v15.75,9.4 7.87,17.27 7.87,76.71 10.16,78.99 v11.05,78.99
!TFT_RST  (via drill 0.39)
  Top 0.254: 25.26,36.24 25.26,33.84 X2.10 25.27,32.77 26.04,32 v35.18,32 | U2.3 52.73,43.84 v52.58,44
  Top 0.406: 25.26,36.24 25.4,36.39 R3.1 25.43,36.52 IC1.2
  Bottom 0.254: v52.58,44 43.62,44 35.18,35.56 v35.18,32
+5V  (via drill 0.5)
  Top 0.406: 13.46,39.88 13.46,38.61 C2.1 13.53,35.95 U3.5 | L1.P$1 10.86,37.61 C5.1 10.86,39.88 13.46,39.88 | 13.46,39.88 13.46,41.21 C16.1
  Top 0.61: D4.C 32.69,66.17 | 32.69,66.17 D3.C | 32.69,66.17 v30.1,66.17 | v11.94,43.69 10.86,42.61 C5.1
  Bottom 0.61: v30.1,66.17 11.94,48.01 v11.94,43.69
+24V
  Top 0.254: 21.77,35.05 21.27,35.05 X2.2 21.27,29.65 20.57,28.96 | 21.77,35.05 22.27,35.05 | X2.5 22.77,35.05 22.27,35.05 | X2.4 22.27,35.05 | X2.3 21.77,35.05
  Top 0.406: 20.57,28.96 15.57,28.96 D2.C 14.3,28.2 C20.1
A
  Top 0.406: TP8.P$1 MS2.5 MS2.5'
ADDR0
  Top 0.254: IC2.14 55.92,36.53 55.63,36.83 55.63,41.02 ICSP_CLK2.1 57.06,42.46 R14.2
ADDR1
  Top 0.254: IC2.13 55.81,35.88 55.07,36.62 55.07,40.52 54.86,40.73 R13.2 54.61,41.11 ICSP_CLK1.1
AREF
  Top 0.406: MS2.3' MS2.3 TP6.P$1
AUX
  Top 0.254: R10.1 R11.2 57.57,39.12 57.57,38.89 IC2.16
B
  Top 0.406: MS2.6' MS2.6 TP9.P$1
C
  Top 0.406: TP11.P$1 MS2.7 MS2.7'
CARDDET
  Top 0.254: X3.CD2 X3.CD1 38.17,15.31 TP2.P$1
D
  Top 0.406: MS2.8' MS2.8 TP12.P$1
E
  Top 0.406: TP13.P$1 MS2.9 MS2.9'
EN  (via drill 0.5)
  Top 0.254: ENABLE.P2 22.86,7.37 16.51,13.72 16.51,22.86 17.53,23.88 29.46,23.88 v30.48,24.89 | v35.56,66.29 TP10.P$1
  Top 0.406: TP10.P$1 MS2.27 42.55,65.79 46.48,65.79 46.86,66.17 MS2.27'
  Bottom 0.254: v30.48,24.89 33.53,27.94 33.53,65.53 34.29,66.29 v35.56,66.29
F
  Top 0.406: TP14.P$1 MS2.10 MS2.10'
G
  Top 0.406: TP20.P$1 MS2.16 23.75,40.89 23.24,40.39 19.69,40.39 MS2.16'
GND  (via drill 0.5)
  Top 0.254: 41.77,29.97 X2.43 41.77,32.65 42.28,32.65 v42.67,32.26
  other vias: 44.83,32.38 16.76,40.13 41.4,1.52 52.83,6.6 42.67,6.35 25.53,5.08 13.72,2.79 21.72,37.46 9.65,35.69 15.37,37.08 12.45,30.1 9.27,41.78 12.07,41.91 26.42,35.31 48.9,34.16 51.44,42.67 58.55,45.47 53.98,37.59
  pour Top: 5.08,85.34 5.08,0 60.96,0 60.96,85.34
  pour Bottom: 5.08,85.34 5.08,0 60.96,0 60.96,85.34
H
  Top 0.406: SJ3.1 MS2.19 MS2.19'
I
  Top 0.406: MS2.20' MS2.20 SJ2.1
J
  Top 0.406: SJ1.1 MS2.21 MS2.21'
K
  Top 0.406: MS2.22' MS2.22 SJ4.1
L
  Top 0.406: TP25.P$1 41.4,56.13 41.4,56.39 42.29,56.39 MS2.23 MS2.23'
LCD_LITE  (via drill 0.5)
  Top 0.203: R6.2 27.85,4.23 25.91,2.29 22.86,2.29
  Top 0.254: U3.4 15.91,35.65 16,35.56 | v16.51,35.05 16,35.56 | ENABLE.P1 22.86,2.29 v22.86,3.3 | 16,35.56 16.26,35.56 TP1.P$1
  Bottom 0.254: v16.51,35.05 16.51,13.46 22.86,7.11 v22.86,3.3
LEDK
  Top 0.254: C18.1 20.45,36.26 20.71,35.99 20.71,33.89 X2.1 20.6,34.01 15.19,34.01 U3.3 15.13,32.08 R1.2
M
  Top 0.406: MS2.24' MS2.24 TP24.P$1
MISO
  Top 0.254: TP17.P$1 28.19,48.51 28.96,47.75 28.96,42.67 36.78,34.85 X2.33 36.77,30.41 42.04,25.15 48.64,25.15 51.05,22.73 51.05,16 41.52,6.46 X3.7
  Top 0.406: TP17.P$1 MS2.13 MS2.13'
MOSI  (via drill 0.5)
  Top 0.254: TP16.P$1 29.21,51.05 29.46,50.8 29.46,42.93 37.27,35.12 X2.34 37.27,31.44 39.37,29.34 v39.37,29.08 | X3.3 45.92,9.34 52.32,15.75 52.32,23.24 v50.04,25.53
  Top 0.406: TP16.P$1 MS2.12 MS2.12'
  Bottom 0.254: v50.04,25.53 49.53,26.03 42.42,26.03 v39.37,29.08
N
  Top 0.406: TP23.P$1 MS2.25 MS2.25'
N$3
  Top 0.406: L1.P$2 10.34,33.32 10.6,33.32 | 10.6,33.32 D2.A | U3.1 13.2,33.32 10.6,33.32
RT_INT  (via drill 0.39)
  Top 0.254: SJ2.2 36.26,48.51 v35.56,47.81 | v57.85,34.1 57.68,33.94 IC2.10
  Bottom 0.254: v35.56,47.81 53.15,47.81 55.56,45.4 55.56,36.39 v57.85,34.1
RX
  Top 0.406: TP18.P$1 MS2.14 MS2.14'
SCL  (via drill 0.39)
  Top 0.203: MS2.18' 47.5,43.43 48.53,42.4 48.53,42.2 v48.5,42.16 | v54.1,35.56 54.55,35.12
  Top 0.254: R4.2 52.7,33.27 54.55,35.12 54.67,35.23 IC2.12 59,35.23 v59.18,35.05 | CONN1.4 34.52,7.09 v34.8,7.37
  Top 0.406: TP26.P$1 MS2.18 42.42,43.81 46.48,43.81 MS2.18'
  Bottom 0.203: v48.5,42.16 48.5,41.02 53.96,35.56 v54.1,35.56
  Bottom 0.254: v34.8,7.37 34.8,7.87 37.59,10.67 54.1,10.67 59.44,16 59.44,34.8 v59.18,35.05
SCLK
  Top 0.254: TP15.P$1 29.46,53.59 29.97,53.09 29.97,43.18 38.27,34.88 X2.36 38.27,31.33 43.99,25.6 48.83,25.6 51.56,22.87 51.56,15.75 43.72,7.9 X3.5
  Top 0.406: TP15.P$1 MS2.11 MS2.11'
SD_CS  (via drill 0.5)
  Top 0.254: X3.2 47.02,9.68 53.59,16.26 v53.59,19.3 | R2.1 34.12,46.04 34.48,45.68 v34.48,45.02 34.48,45.66 34.8,45.97 SJ3.2
  Bottom 0.254: v53.59,19.3 53.59,19.81 49.02,24.38 37.72,24.38 34.04,28.07 34.04,44.58 v34.48,45.02
SDA  (via drill 0.39)
  Top 0.203: v48.01,39.5 48.01,39.69 46.86,40.83 MS2.17'
  Top 0.254: R9.2 54.23,33.66 v54.55,33.97 55.16,34.59 IC2.11 | CONN1.3 v33.52,7.36 v33.53,7.37
  Top 0.406: TP27.P$1 MS2.17 42.55,40.39 46.48,40.39 46.86,40.77 MS2.17'
  Bottom 0.203: v54.55,33.97 53.28,33.97 48.01,39.24 v48.01,39.5
  Bottom 0.254: v33.53,7.37 37.34,11.18 53.85,11.18 58.98,16.31 58.98,29.54 v54.55,33.97
TFT_CS  (via drill 0.5)
  Top 0.254: v35.05,40.77 35.05,39.62 39.27,35.41 X2.38 | R5.1 35.56,50.29 | 35.56,50.29 36.83,50.29 SJ1.2 | 35.56,50.29 v35.18,49.91
  Bottom 0.254: v35.05,40.77 35.05,41.21 34.49,41.77 34.49,43.83 35.26,44.6 35.26,45.51 33.99,46.79 33.99,48.72 v35.18,49.91
TFT_DC
  Top 0.254: X2.37 38.77,35.14 30.48,43.43 30.48,52.32 32,53.85 37.34,53.85 SJ4.2
TSC_PWR
  Top 0.254: C6.1 48.97,37.84 IC2.1 50.48,38.03 C7.1 50.14,39.59 U2.5
TX
  Top 0.406: TP19.P$1 MS2.15 23.75,43.43 23.37,43.81 19.56,43.81 MS2.15'
USB
  Top 0.406: MS2.26' MS2.26 TP22.P$1
  Top 0.61: TP22.P$1 D4.A
VBAT
  Top 0.254: MS2.28' 55.75,68.83 59.56,65.02 59.56,41.19 R10.2
  Top 0.406: TP21.P$1 MS2.28 42.55,69.34 46.23,69.34 46.74,68.83 MS2.28'
  Top 0.61: D3.A TP21.P$1
XL
  Top 0.203: X2.46 43.33,33.89 43.33,35.14 43.88,35.7 49.6,35.7 49.79,35.88 IC2.4
XR
  Top 0.203: IC2.2 49.85,37.19 49.28,36.61 43.34,36.61 42.27,35.54 X2.44
YD
  Top 0.203: IC2.3 49.79,36.53 49.41,36.15 43.77,36.15 42.77,35.16 X2.45
YU
  Top 0.203: IC2.5 44,35.23 43.77,35.01 X2.47

### Text on the board
Pinguin_tBackup: DC | TCS | IRQ | SCS | A1 | A0 | LITE | 3.5" 480x320 TFT / FeatherWing V2 | TSC2007 I2C 0x48 / Touch Controller | SDDET | Stemma / QT I2C | Enable | Reset | OFF | ON | MicroSD